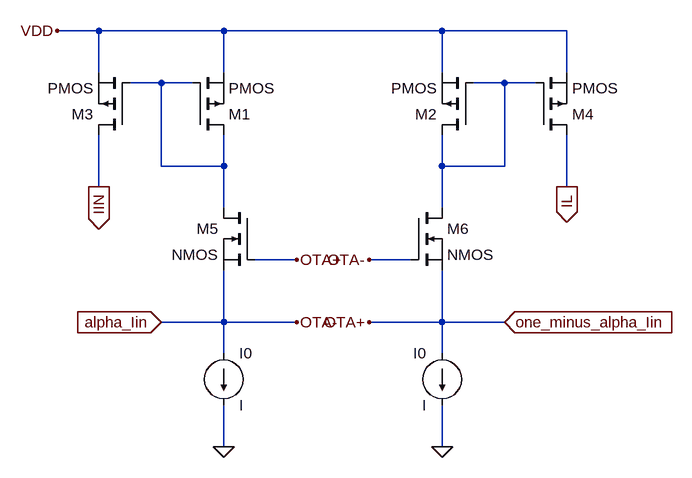
[diagram p0: schematic CE.asc]
CE.asc, the LTspice schematic file:
Version 4
SHEET 1 928 752
WIRE 32 96 -32 96
WIRE 224 96 32 96
WIRE 560 96 224 96
WIRE 752 96 560 96
WIRE 32 160 32 96
WIRE 224 160 224 96
WIRE 560 160 560 96
WIRE 752 160 752 96
WIRE 128 176 80 176
WIRE 176 176 128 176
WIRE 656 176 608 176
WIRE 704 176 656 176
WIRE 128 304 128 176
WIRE 224 304 224 256
WIRE 224 304 128 304
WIRE 560 304 560 256
WIRE 656 304 656 176
WIRE 656 304 560 304
WIRE 32 336 32 256
WIRE 752 336 752 256
WIRE 224 368 224 304
WIRE 560 368 560 304
WIRE 336 448 272 448
WIRE 512 448 448 448
WIRE 224 544 224 464
WIRE 224 544 128 544
WIRE 336 544 224 544
WIRE 560 544 560 464
WIRE 560 544 448 544
WIRE 656 544 560 544
WIRE 224 592 224 544
WIRE 560 592 560 544
WIRE 224 736 224 672
WIRE 560 736 560 672
FLAG 32 336 IIN
IOPIN 32 336 Out
FLAG 224 736 0
FLAG 128 544 alpha_Iin
IOPIN 128 544 In
FLAG 752 336 IL
IOPIN 752 336 Out
FLAG 560 736 0
FLAG 656 544 one_minus_alpha_Iin
IOPIN 656 544 In
FLAG -32 96 VDD
FLAG 336 448 OTA+
FLAG 448 544 OTA+
FLAG 448 448 OTA-
FLAG 336 544 OTA-
SYMBOL current 224 592 R0
SYMATTR InstName I0
SYMBOL current 560 592 M0
SYMATTR InstName I0
SYMBOL nmos 272 368 M0
SYMATTR InstName M5
SYMBOL nmos 512 368 R0
SYMATTR InstName M6
SYMBOL pmos 80 256 R180
SYMATTR InstName M3
SYMBOL pmos 608 256 R180
SYMATTR InstName M2
SYMBOL pmos 176 256 M180
SYMATTR InstName M1
SYMBOL pmos 704 256 M180
SYMATTR InstName M4

The netlist it stands for:
* CE.asc
I0 OTA- 0 I
I0 OTA+ 0 I
M5 N001 OTA+ OTA- OTA- NMOS
M6 N002 OTA- OTA+ OTA+ NMOS
M3 IIN N001 VDD VDD PMOS
M2 N002 N002 VDD VDD PMOS
M1 N001 N001 VDD VDD PMOS
M4 IL N002 VDD VDD PMOS
.model NMOS NMOS
.model PMOS PMOS
.lib standard.mos
.backanno
.end